# EasyEDA Pro project ProPrj_StepCtlBoard_V1.2_2024-07-15.epro, board PCB1
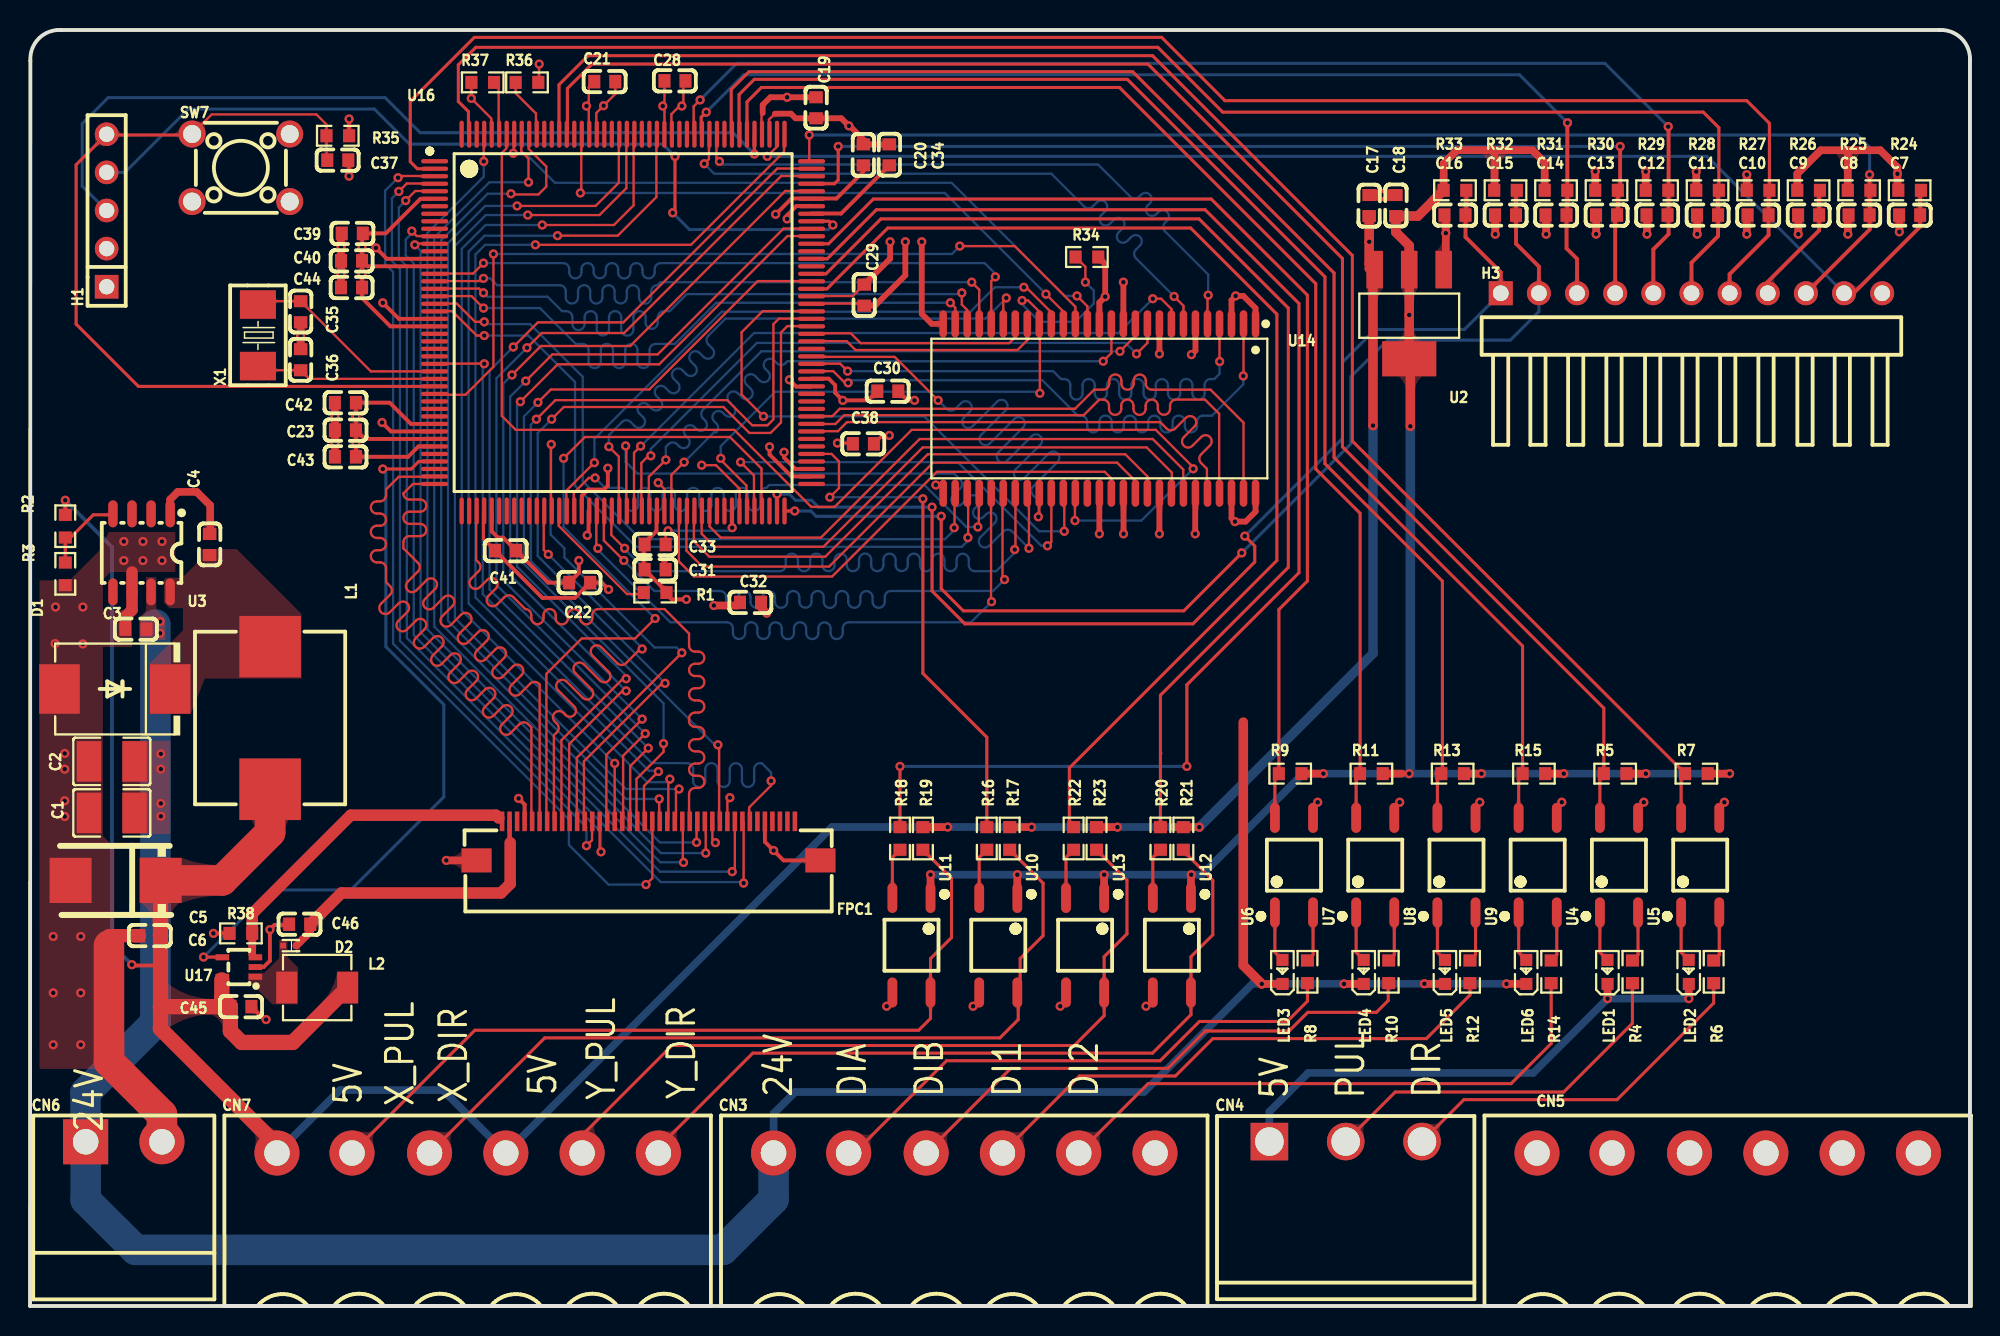
[diagram p2: board, top side]
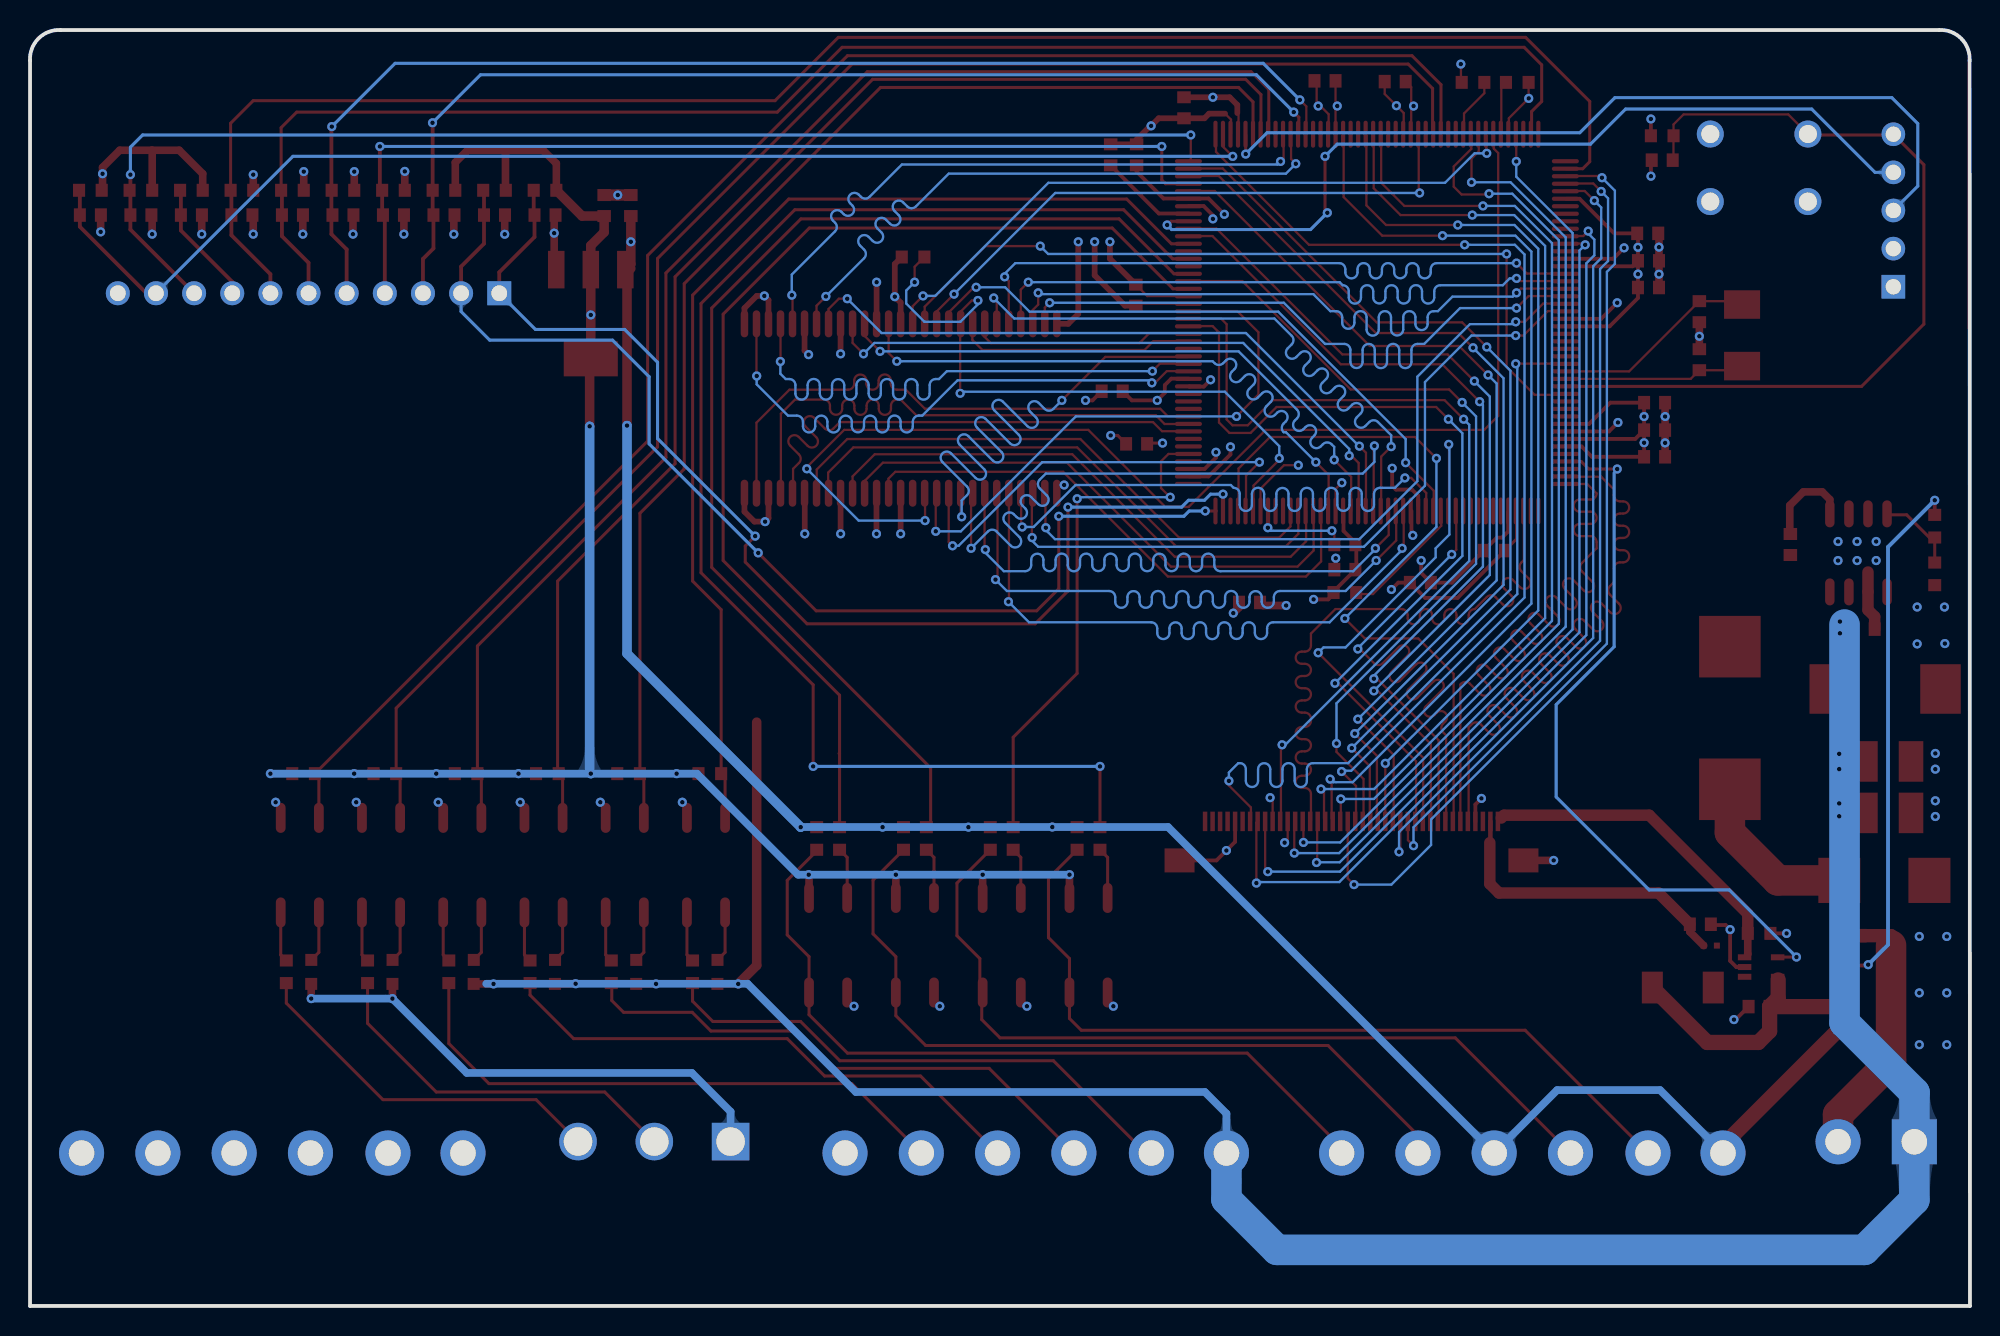
[diagram p3: board, bottom side, seen from below]

Outline 129.18 x 85 mm; copper layers: Top Layer, Inner1, Inner2, Bottom Layer. Coordinates in mm from the lower left corner of the outline.
Outline path: 0,0 0.02,82.97 arc(0.59,84.44) 2.06,85 127.15,85 arc(128.62,84.44) 129.18,82.97 129.18,0 0,0
Stack: Top Layer 0.035mm 外层铜厚1oz / Dielectric1 0.2104mm 7628 RC49% 8.6mil / Inner1 0.0152mm 内层铜厚 / Dielectric2 1.065mm 1.1mm H/HOZ 含铜 / Inner2 0.0152mm 内层铜厚 / Dielectric3 0.2104mm 7628 RC49% 8.6mil / Bottom Layer 0.035mm 外层铜厚1oz

## Design rules (mm)
template: 自定义配置
spacing copperThickness1oz (default): track to track 0.305, other pairs 0.152 to 0.3
spacing copperThickness2oz: track to track 0.203, other pairs 0.152 to 0.3
track width copperThickness1oz (default): min 0.127, default 0.254, max 2.54
track width copperThickness2oz: min 0.203, default 0.254, max 2.54
differential pair differentialPair (default): width min 0.127, default 0.254, max 2.54; gap min 0.152, default 0.152
via viaSize (default): diameter min 0.5, default 0.61, max 10; hole min 0.3, default 0.305, max 6.299

## Placement (name value [footprint] x y rotation side)
C1  4.7uF  [C1210]  5.44 32.85 0 top
C2  4.7uF  [C1210]  5.44 36.28 0 top
C3  10nF  [C0603]  7.05 45.09 180 top
C4  10nF  [C0603]  11.96 50.73 270 top
C5  330uF  [CASE-D_7343]  5.7 28.35 0 top
C6  10nF  [C0603]  7.99 24.67 0 top
C7  100nF  [C0603]  125.17 72.67 180 top
C8  100nF  [C0603]  121.8 72.67 180 top
C9  100nF  [C0603]  118.44 72.67 180 top
C10  100nF  [C0603]  115.07 72.67 180 top
C11  100nF  [C0603]  111.71 72.67 180 top
C12  100nF  [C0603]  108.35 72.67 180 top
C13  100nF  [C0603]  104.98 72.67 180 top
C14  100nF  [C0603]  101.62 72.67 180 top
C15  100nF  [C0603]  98.25 72.67 180 top
C16  100nF  [C0603]  94.89 72.67 180 top
C17  100nF  [C0603]  89.18 73.31 90 top
C18  100nF  [C0603]  90.95 73.31 270 top
C19  100nF  [C0603]  52.34 79.82 270 top
C20  100nF  [C0603]  55.5 76.69 90 top
C21  100nF  [C0603]  38.27 81.56 0 top
C22  100nF  [C0603]  36.6 48.19 0 top
C23  100nF  [C0603]  21 58.35 180 top
C28  100nF  [C0603]  42.95 81.61 0 top
C29  100nF  [C0603]  55.55 67.34 270 top
C30  100nF  [C0603]  57.12 60.94 0 top
C31  100nF  [C0603]  41.63 49.05 180 top
C32  100nF  [C0603]  47.98 46.87 0 top
C33  2.2uF  [C0603]  41.63 50.73 0 top
C34  2.2uF  [C0603]  57.22 76.69 270 top
C35  22pF  [C0603]  18.02 66.24 270 top
C36  22pF  [C0603]  18.02 63.04 90 top
C37  100nF  [C0603]  20.49 76.33 0 top
C38  100nF  [C0603]  55.5 57.43 0 top
C39  100nF  [C0603]  21.46 71.45 180 top
C40  100nF  [C0603]  21.41 69.63 180 top
C41  100nF  [C0603]  31.67 50.32 180 top
C42  100nF  [C0603]  21 60.18 180 top
C43  100nF  [C0603]  21 56.57 180 top
C44  100nF  [C0603]  21.41 67.85 180 top
C45  4.7uF  [C0603]  14.04 19.94 180 top
C46  4.7uF  [C0603]  17.95 25.43 0 top
CN3  WJ2EDGRC-5.08-6P  [CONN-TH_WJ2EDGRC-5.08-6P]  62.21 10.19 0 top
CN4  WJ2EDGRC-5.08-3P  [CONN-TH_3P-P5.08_WJ2EDGRC-5.08-3P]  87.61 10.95 0 top
CN5  WJ2EDGRC-5.08-6P  [CONN-TH_WJ2EDGRC-5.08-6P]  113.05 10.19 0 top
CN6  WJ2EDGRC-5.08-2P  [CONN-TH_2P-P5.08_WJ2EDGRC-5.08-2P]  6.24 10.94 0 top
CN7  WJ2EDGRC-5.08-6P  [CONN-TH_WJ2EDGRC-5.08-6P]  29.14 10.19 0 top
D1  SK1045C  [SMC_L6.9-W5.9-LS7.9-RD]  5.65 41.1 180 top
D2  NSR0240P2T5G  [SOD-923_L0.8-W0.6-LS1.0-RD-1]  17.29 24.01 180 top
FPC1  AFC01-S40FCA-00  [FPC-SMD_P0.50-40P_FGS-XJ-H2.0]  41.19 30.98 180 top
H1  -  [HDR-TH_5P-P2.54-V-F]  5.1 72.98 90 top
H3  PZ254-1-11-W-8.5  [HDR-TH_11P-P2.54-H-M-W10.4-N]  110.64 67.47 0 top
L1  15uH  [IND-SMD_L11.5-W10.0_FXL1040]  15.99 39.17 270 top
L2  4.7uH  [IND-SMD_L4.4-W4.2]  19.12 21.21 0 top
LED1  NCD0603B1  [LED0603-RD]  105.05 22.25 90 top
LED2  NCD0603B1  [LED0603-RD]  110.46 22.25 90 top
LED3  NCD0603B1  [LED0603-RD]  83.41 22.25 90 top
LED4  NCD0603B1  [LED0603-RD]  88.82 22.25 90 top
LED5  NCD0603B1  [LED0603-RD]  94.23 22.25 90 top
LED6  NCD0603B1  [LED0603-RD]  99.64 22.25 90 top
R1  10K  [R0603]  41.63 47.53 0 top
R2  10K  [R0603]  2.35 51.95 90 top
R3  3.16K  [R0603]  2.35 48.77 90 top
R4  1K  [R0603]  106.71 22.26 270 top
R5  2K  [R0603]  105.56 35.46 180 top
R6  1K  [R0603]  112.12 22.26 270 top
R7  2K  [R0603]  110.97 35.46 180 top
R8  4.7K  [R0603]  85.07 22.26 270 top
R9  2K  [R0603]  83.91 35.46 180 top
R10  4.7K  [R0603]  90.48 22.26 270 top
R11  2K  [R0603]  89.33 35.46 180 top
R12  4.7K  [R0603]  95.89 22.26 270 top
R13  2K  [R0603]  94.73 35.46 180 top
R14  4.7K  [R0603]  101.3 22.26 270 top
R15  2K  [R0603]  100.15 35.46 180 top
R16  680R  [R0603]  63.71 31.14 90 top
R17  1K  [R0603]  65.24 31.14 270 top
R18  680R  [R0603]  57.93 31.14 90 top
R19  1K  [R0603]  59.46 31.14 270 top
R20  680R  [R0603]  75.28 31.14 90 top
R21  1K  [R0603]  76.8 31.14 270 top
R22  680R  [R0603]  69.5 31.14 90 top
R23  1K  [R0603]  71.02 31.14 270 top
R24  10K  [R0603]  125.17 74.32 180 top
R25  10K  [R0603]  121.8 74.32 180 top
R26  10K  [R0603]  118.44 74.32 180 top
R27  10K  [R0603]  115.07 74.32 180 top
R28  10K  [R0603]  111.71 74.32 180 top
R29  10K  [R0603]  108.35 74.32 180 top
R30  10K  [R0603]  104.98 74.32 180 top
R31  10K  [R0603]  101.62 74.32 180 top
R32  10K  [R0603]  98.25 74.32 180 top
R33  10K  [R0603]  94.89 74.32 180 top
R34  10K  [R0603]  70.38 69.88 180 top
R35  10K  [R0603]  20.49 77.96 0 top
R36  10K  [R0603]  33.09 81.51 0 top
R37  10K  [R0603]  30.15 81.51 180 top
R38  10.2R  [R0603]  14.04 24.82 0 top
SW7  TS-1002-07026  [SW-TH_4P-L6.0-W6.0-P4.50-LS6.5]  14.04 75.82 0 top
U2  AMS1117-3.3  [SOT-223-3_L6.5-W3.5-P3.05-LS7.0]  91.84 66.07 90 top
U3  TPS5450DDAR  [soic-8_l5.3-w3.9-p1.27-ls6.0-bl]  7.43 50.17 180 top
U4  TLP185(GRL-TL,SE(T  [SOIC-4_L3.6-W4.4-P2.54-LS7.0-TL]  105.81 29.37 90 top
U5  TLP185(GRL-TL,SE(T  [SOIC-4_L3.6-W4.4-P2.54-LS7.0-TL]  111.22 29.37 90 top
U6  TLP185(GRL-TL,SE(T  [SOIC-4_L3.6-W4.4-P2.54-LS7.0-TL]  84.17 29.37 90 top
U7  TLP185(GRL-TL,SE(T  [SOIC-4_L3.6-W4.4-P2.54-LS7.0-TL]  89.58 29.37 90 top
U8  TLP185(GRL-TL,SE(T  [SOIC-4_L3.6-W4.4-P2.54-LS7.0-TL]  94.99 29.37 90 top
U9  TLP185(GRL-TL,SE(T  [SOIC-4_L3.6-W4.4-P2.54-LS7.0-TL]  100.4 29.37 90 top
U10  TLP185(GRL-TL,SE(T  [SOIC-4_L3.6-W4.4-P2.54-LS7.0-TL]  64.48 24.03 270 top
U11  TLP185(GRL-TL,SE(T  [SOIC-4_L3.6-W4.4-P2.54-LS7.0-TL]  58.7 24.03 270 top
U12  TLP185(GRL-TL,SE(T  [SOIC-4_L3.6-W4.4-P2.54-LS7.0-TL]  76.04 24.03 270 top
U13  TLP185(GRL-TL,SE(T  [SOIC-4_L3.6-W4.4-P2.54-LS7.0-TL]  70.26 24.03 270 top
U14  W9825G6KH-6  [TSOP-54_L22.2-W10.2-P0.80-LS11.8-BL]  71.21 59.79 180 top
U16  STM32F429IGT6  [LQFP-176_L24.0-W24.0-P0.50-LS26.0-BL]  39.49 65.51 270 top
U17  TPS61169DCKR  [SC-70-5_L2.1-W1.3-P0.65-LS2.1-BR]  13.91 22.58 0 top
X1  8MHz  [CRYSTAL-SMD_L5.0-W3.2]  15.18 64.66 90 top

## Footprints (pads in the part's own frame, mm; a bottom-side part is the same pattern mirrored in y, then rotated)
C0603
  rect 0.8x0.9 smd: 1(-0.7,0) 2(0.7,0)
C1210
  rect 1.635x2.7 smd: 1(-1.518,0) 2(1.518,0)
CASE-D_7343
  rect 2.799x3.01 smd: 1(3,0) 2(-3,0)
CONN-TH_2P-P5.08_WJ2EDGRC-5.08-2P
  rect 3x3 hole 1.7: 1(-2.54,0)
  round 3 hole 1.7: 2(2.54,0)
CONN-TH_3P-P5.08_WJ2EDGRC-5.08-3P
  rect 2.5x2.5 hole 1.9: 1(-5.08,0)
  round 2.5 hole 1.9: 2(0,0) 3(5.08,0)
CONN-TH_WJ2EDGRC-5.08-6P
  round 3 hole 1.7: 1(-12.7,0) 2(-7.702,0) 3(-2.54,0) 4(2.54,0) 5(7.62,0) 6(12.7,0)
CRYSTAL-SMD_L5.0-W3.2
  rect 1.9x2.4 smd: 1(-2.05,0) 2(2.05,0)
FPC-SMD_P0.50-40P_FGS-XJ-H2.0
  rect 0.3x1.3 smd: 1(9.75,-1.3) 2(9.25,-1.3) 3(8.75,-1.3) 4(8.25,-1.3) 5(7.75,-1.3) 6(7.25,-1.3) 7(6.75,-1.3) 8(6.25,-1.3) 9(5.75,-1.3) 10(5.25,-1.3) 11(4.75,-1.3) 12(4.25,-1.3) 13(3.75,-1.3) 14(3.25,-1.3) 15(2.75,-1.3) 16(2.25,-1.3) 17(1.75,-1.3) 18(1.25,-1.3) 19(0.75,-1.3) 20(0.25,-1.3) 21(-0.25,-1.3) 22(-0.75,-1.3) 23(-1.25,-1.3) 24(-1.75,-1.3) 25(-2.25,-1.3) 26(-2.75,-1.3) 27(-3.25,-1.3) 28(-3.75,-1.3) 29(-4.25,-1.3) 30(-4.75,-1.3) 31(-5.25,-1.3) 32(-5.75,-1.3) 33(-6.25,-1.3) 34(-6.75,-1.3) 35(-7.25,-1.3) 36(-7.75,-1.3) 37(-8.25,-1.3) 38(-8.75,-1.3) 39(-9.25,-1.3) 40(-9.75,-1.3)
  rect 2x1.6 smd: 41(-11.45,1.3) 42(11.45,1.3)
HDR-TH_5P-P2.54-V-F
  rect 1.575x1.575 hole 1.02: 1(-5.08,0)
  round 1.575 hole 1.02: 2(-2.54,0) 3(0,0) 4(2.54,0) 5(5.08,0)
HDR-TH_11P-P2.54-H-M-W10.4-N
  rect 1.6x1.6 hole 1.05: 1(-12.7,0)
  round 1.6 hole 1.05: 2(-10.16,0) 3(-7.62,0) 4(-5.08,0) 5(-2.54,0) 6(0,0) 7(2.54,0) 8(5.08,0) 9(7.62,0) 10(10.16,0) 11(12.7,0)
IND-SMD_L4.4-W4.2
  rect 1.4x2.12 smd: 1(2.028,0) 2(-2.028,0)
IND-SMD_L11.5-W10.0_FXL1040
  rect 4.1x4.1 smd: 1(-4.75,0) 2(4.75,0)
LED0603-RD
  rect 0.8x0.8 smd: 1(-0.799,-0.004) 2(0.799,0.004)
LQFP-176_L24.0-W24.0-P0.50-LS26.0-BL
  oval 0.28x1.8 smd: 1(-10.75,-12.55) 2(-10.25,-12.55) 3(-9.75,-12.55) 4(-9.25,-12.55) 5(-8.75,-12.55) 6(-8.25,-12.55) 7(-7.75,-12.55) 8(-7.25,-12.55) 9(-6.75,-12.55) 10(-6.25,-12.55) 11(-5.75,-12.55) 12(-5.25,-12.55) 13(-4.75,-12.55) 14(-4.25,-12.55) 15(-3.75,-12.55) 16(-3.25,-12.55) 17(-2.75,-12.55) 18(-2.25,-12.55) 19(-1.75,-12.55) 20(-1.25,-12.55) 21(-0.75,-12.55) 22(-0.25,-12.55) 23(0.25,-12.55) 24(0.75,-12.55) 25(1.25,-12.55) 26(1.75,-12.55) 27(2.25,-12.55) 28(2.75,-12.55) 29(3.25,-12.55) 30(3.75,-12.55) 31(4.25,-12.55) 32(4.75,-12.55) 33(5.25,-12.55) 34(5.75,-12.55) 35(6.25,-12.55) 36(6.75,-12.55) 37(7.25,-12.55) 38(7.75,-12.55) 39(8.25,-12.55) 40(8.75,-12.55) 41(9.25,-12.55) 42(9.75,-12.55) 43(10.25,-12.55) 44(10.75,-12.55) 89(10.75,12.55) 90(10.25,12.55) 91(9.75,12.55) 92(9.25,12.55) 93(8.75,12.55) 94(8.25,12.55) 95(7.75,12.55) 96(7.25,12.55) 97(6.75,12.55) 98(6.25,12.55) 99(5.75,12.55) 100(5.25,12.55) 101(4.75,12.55) 102(4.25,12.55) 103(3.75,12.55) 104(3.25,12.55) 105(2.75,12.55) 106(2.25,12.55) 107(1.75,12.55) 108(1.25,12.55) 109(0.75,12.55) 110(0.25,12.55) 111(-0.25,12.55) 112(-0.75,12.55) 113(-1.25,12.55) 114(-1.75,12.55) 115(-2.25,12.55) 116(-2.75,12.55) 117(-3.25,12.55) 118(-3.75,12.55) 119(-4.25,12.55) 120(-4.75,12.55) 121(-5.25,12.55) 122(-5.75,12.55) 123(-6.25,12.55) 124(-6.75,12.55) 125(-7.25,12.55) 126(-7.75,12.55) 127(-8.25,12.55) 128(-8.75,12.55) 129(-9.25,12.55) 130(-9.75,12.55) 131(-10.25,12.55) 132(-10.75,12.55)
  oval 1.8x0.28 smd: 45(12.55,-10.75) 46(12.55,-10.25) 47(12.55,-9.75) 48(12.55,-9.25) 49(12.55,-8.75) 50(12.55,-8.25) 51(12.55,-7.75) 52(12.55,-7.25) 53(12.55,-6.75) 54(12.55,-6.25) 55(12.55,-5.75) 56(12.55,-5.25) 57(12.55,-4.75) 58(12.55,-4.25) 59(12.55,-3.75) 60(12.55,-3.25) 61(12.55,-2.75) 62(12.55,-2.25) 63(12.55,-1.75) 64(12.55,-1.25) 65(12.55,-0.75) 66(12.55,-0.25) 67(12.55,0.25) 68(12.55,0.75) 69(12.55,1.25) 70(12.55,1.75) 71(12.55,2.25) 72(12.55,2.75) 73(12.55,3.25) 74(12.55,3.75) 75(12.55,4.25) 76(12.55,4.75) 77(12.55,5.25) 78(12.55,5.75) 79(12.55,6.25) 80(12.55,6.75) 81(12.55,7.25) 82(12.55,7.75) 83(12.55,8.25) 84(12.55,8.75) 85(12.55,9.25) 86(12.55,9.75) 87(12.55,10.25) 88(12.55,10.75) 133(-12.55,10.75) 134(-12.55,10.25) 135(-12.55,9.75) 136(-12.55,9.25) 137(-12.55,8.75) 138(-12.55,8.25) 139(-12.55,7.75) 140(-12.55,7.25) 141(-12.55,6.75) 142(-12.55,6.25) 143(-12.55,5.75) 144(-12.55,5.25) 145(-12.55,4.75) 146(-12.55,4.25) 147(-12.55,3.75) 148(-12.55,3.25) 149(-12.55,2.75) 150(-12.55,2.25) 151(-12.55,1.75) 152(-12.55,1.25) 153(-12.55,0.75) 154(-12.55,0.25) 155(-12.55,-0.25) 156(-12.55,-0.75) 157(-12.55,-1.25) 158(-12.55,-1.75) 159(-12.55,-2.25) 160(-12.55,-2.75) 161(-12.55,-3.25) 162(-12.55,-3.75) 163(-12.55,-4.25) 164(-12.55,-4.75) 165(-12.55,-5.25) 166(-12.55,-5.75) 167(-12.55,-6.25) 168(-12.55,-6.75) 169(-12.55,-7.25) 170(-12.55,-7.75) 171(-12.55,-8.25) 172(-12.55,-8.75) 173(-12.55,-9.25) 174(-12.55,-9.75) 175(-12.55,-10.25) 176(-12.55,-10.75)
R0603
  rect 0.806x0.864 smd: 1(-0.753,0) 2(0.753,0)
SC-70-5_L2.1-W1.3-P0.65-LS2.1-BR
  rect 0.9x0.4 smd: 1(1.1,-0.65) 2(1.1,0) 3(1.1,0.65) 4(-1.1,0.65) 5(-1.1,-0.65)
SMC_L6.9-W5.9-LS7.9-RD
  rect 2.7x3.3 smd: 1(-3.687,0) 2(3.687,0)
SOD-923_L0.8-W0.6-LS1.0-RD-1
  rect 0.4x0.4 smd: 1(-0.44,0) 2(0.44,0)
SOIC-4_L3.6-W4.4-P2.54-LS7.0-TL
  oval 2x0.65 smd: 1(-3.15,1.27) 3(-3.15,-1.27) 4(3.15,-1.27) 6(3.15,1.27)
soic-8_l5.3-w3.9-p1.27-ls6.0-bl
  oval 0.63x1.8 smd: 1(-1.905,-2.6) 2(-0.635,-2.6) 3(0.635,-2.6) 4(1.905,-2.6) 5(1.905,2.6) 6(0.635,2.6) 7(-0.635,2.6) 8(-1.905,2.6)
SOT-223-3_L6.5-W3.5-P3.05-LS7.0
  rect 2.5x1.1 smd: 1(2.97,-2.3) 2(2.97,0) 3(2.97,2.3)
  rect 2.34x3.6 smd: 4(-2.97,0)
SW-TH_4P-L6.0-W6.0-P4.50-LS6.5
  round 1.8 hole 1.2: 1(-3.25,2.25) 2(3.25,2.25) 3(-3.25,-2.25) 4(3.25,-2.25)
TSOP-54_L22.2-W10.2-P0.80-LS11.8-BL
  oval 0.5x1.8 smd: 1(-10.4,-5.642) 2(-9.6,-5.642) 3(-8.8,-5.642) 4(-8,-5.642) 5(-7.2,-5.642) 6(-6.4,-5.642) 7(-5.6,-5.642) 8(-4.8,-5.642) 9(-4,-5.642) 10(-3.2,-5.642) 11(-2.4,-5.642) 12(-1.6,-5.642) 13(-0.8,-5.642) 14(0,-5.642) 15(0.8,-5.642) 16(1.6,-5.642) 17(2.4,-5.642) 18(3.2,-5.642) 19(4,-5.642) 20(4.8,-5.642) 21(5.6,-5.642) 22(6.4,-5.642) 23(7.2,-5.642) 24(8,-5.642) 25(8.8,-5.642) 26(9.6,-5.642) 27(10.4,-5.642) 28(10.4,5.642) 29(9.6,5.642) 30(8.8,5.642) 31(8,5.642) 32(7.2,5.642) 33(6.4,5.642) 34(5.6,5.642) 35(4.8,5.642) 36(4,5.642) 37(3.2,5.642) 38(2.4,5.642) 39(1.6,5.642) 40(0.8,5.642) 41(0,5.642) 42(-0.8,5.642) 43(-1.6,5.642) 44(-2.4,5.642) 45(-3.2,5.642) 46(-4,5.642) 47(-4.8,5.642) 48(-5.6,5.642) 49(-6.4,5.642) 50(-7.2,5.642) 51(-8,5.642) 52(-8.8,5.642) 53(-9.6,5.642) 54(-10.4,5.642)

## Nets
As in the schematic.

Pads without a net: FPC1 3 35 37 38 39 40; SW7 2 4; U3 2 3 5; U14 40; U16 1 7 8 9 10 13 24 25 26 27 33 34 35 40 42 45 46 50 51 52 53 54 55 79 80 86 89 92 94 95 99 100 101 107 118 120 141 146 147 151 152 156 157 161 164 165 174 176

## Via types
v1: diameter 0.61, hole 0.305, Top Layer to Bottom Layer, 278 vias

## Routing (per net, layer and track width the routed paths; a pad name or vN(x,y) marks a point on that pad's centre or on a via; arc(x,y) is an arc through that point)
3V3: length 271.8
  Top Layer w0.152: v1(41.83,54.84) 42.24,54.43 42.24,53.47 ; 37.21,78.08 37.21,81.2 C21.1 ; C29.1 54.78,67.28 52.01,67.28 ; 48.71,79.33 48.71,78.08 ; 30.71,78.08 30.71,79.12 29.39,80.44 R37.2 ; 42.21,78.08 42.25,78.12 C28.1 ; 47.24,53.47 47.24,54.44 45.68,56.01 v1(44.73,56.01) ; FPC1.31 46.44,33.69 v1(46.61,33.86)
  Top Layer w0.203: v1(53.77,57.48) 54.74,57.48 C38.1
  Top Layer w0.254: 26.89,58.76 25.36,58.76 23.95,60.18 C42.1 v1(21.7,59.25) C23.1 ; 26.89,57.26 25.87,57.26 25.17,56.57 C43.1 v1(21.7,57.51) C23.1 ; C40.1 v1(22.11,70.53) 22.11,71.4 C39.1 23.54,71.45 ; C40.1 22.47,69.26 26.74,69.26 ; C40.1 v1(22.11,68.74) C44.1 22.11,67.15 24,65.26 26.89,65.26 ; 26.89,73.76 26,73.76 23.69,71.45 ; v1(32.53,33.81) 32.94,33.41 FPC1.4 ; C30.1 55.81,60.33 v1(54.12,60.33) 53.62,60.84 53.62,61.34 53.18,61.78 52.01,61.78 ; v1(37.11,51.34) 37.19,51.42 37.19,52.96 ; v1(42.24,49.81) 42.24,49.14 C31.1 ; 30.75,52.9 30.75,51.6 31.16,51.18 31.51,51.18 C41.1 34.5,48.19 C22.1 36.55,48.84 v1(36.55,49.66) ; C23.1 22.29,57.76 26.89,57.76 ; R35.2 v1(21.25,79.07) ; 51.99,55.76 50.97,55.76 50.21,56.52 v1(50.21,56.87) ; v1(49.65,72.72) 50.71,73.78 53.7,73.78 55.5,75.57 C20.1
  Top Layer w0.381: 48.79,79.47 48.79,80.01 49.3,80.52 v1(50.42,80.52) C19.1 ; 80.01,65.43 80.01,67.01 v1(80.29,67.29) 80.79,67.29 81.61,66.47 81.61,65.43 ; v1(59.38,70.9) 59.38,66.09 60.05,65.43 60.81,65.43 ; U14.43 72.82,54.13 v1(72.82,51.44) ; C29.1 57.27,69.77 v1(57.27,70.9) ; 75.21,65.43 v1(75.21,63.43) ; U14.49 77.59,54.13 v1(77.59,51.44) ; R34.1 71.6,69.41 v1(71.6,67.24) 71.21,66.85 71.21,65.43
  Top Layer w0.508: 97.52,76.99 100.05,76.99 100.86,76.18 R31.2 ; 97.52,76.99 97.52,74.35 R32.2 ; 97.52,76.99 95.02,76.99 94.14,76.11 R33.2 ; R7.1 v1(113.18,35.46) ; 121.07,76.99 121.05,76.97 R25.2 ; 121.07,76.99 123.21,76.99 124.35,75.85 v1(124.35,75.42) 124.35,74.38 R24.2 ; 121.07,76.99 119.25,76.99 117.68,75.43 R26.2 ; 65.75,27.18 v1(65.75,28.73) ; v1(114.32,75.37) R27.2 ; 77.31,27.18 77.31,28.73 ; R13.1 96.67,35.46 ; R15.1 102.13,35.46 ; R11.1 91.33,35.46 ; 59.97,27.18 v1(59.97,28.73) ; v1(45.54,46.66) 47.07,46.66 C32.1 ; 104.23,74.34 v1(104.23,75.58) ; R29.2 v1(107.59,75.57) ; 71.53,27.18 v1(71.53,28.73) ; R5.1 107.59,35.46 ; R28.2 v1(110.96,75.57) ; R9.1 v1(86.13,35.46)
  Top Layer w0.635: R33.2 92.42,72.61 C18.2 90.95,71.53 91.84,70.64 U2.2 v1(91.84,66.02) U2.4 91.92,63.02 v1(91.92,58.6)
  Bottom Layer w0.508: v1(59.97,28.73) v1(65.75,28.73) v1(71.53,28.73) v1(77.33,28.73) 78.04,28.73 84.77,35.46 v1(86.13,35.46) v1(91.84,35.46) v1(96.66,35.46) v1(102.13,35.46) v1(107.6,35.46) v1(113.18,35.46)
  Bottom Layer w0.635: v1(91.92,58.6) 91.92,35.54 v1(91.84,35.46)
  vias: v1(29.38,80.45) v1(37.05,79.94) v1(42.13,79.94)
+5V: length 212.7
  Top Layer w0.254: 8.69,22.68 6.83,22.68 v1(6.78,22.74) ; R2.2 v1(2.35,53.67)
  Top Layer w0.508: 77.87,31.9 v1(77.86,31.9) ; v1(77.86,31.9) R21.1 76.11,31.9 ; v1(77.86,31.9) 77.87,31.91 ; R17.1 v1(66.7,31.9) ; R19.1 61.11,31.9 ; R23.1 v1(72.41,31.9)
  Top Layer w0.635: C17.1 v1(89.18,70.9) 89.18,69.41 U2.3 ; v1(89.43,58.65) 89.43,68.86 89.18,69.12
  Top Layer w1.016: C45.2 8.72,19.94 8.69,19.9 ; C45.2 12.77,20.51 12.77,21.72 ; C45.2 13.34,18.31 14.09,17.56 17.49,17.56 L2.1 ; 8.69,19.9 C6.2 8.69,28.34 C5.1 ; 8.69,19.9 8.69,18.47 16.44,10.71 CN7.1
  Top Layer w2.032: C5.1 12.8,28.35 15.99,31.54 15.99,34.62
  Bottom Layer w0.254: v1(2.35,53.67) 5.46,50.56 5.46,24.06 v1(6.78,22.74)
  Bottom Layer w0.508: CN7.1 20.63,14.38 27.49,14.38 CN7.4 53.4,31.91 v1(61.11,31.91) 77.87,31.91
  Bottom Layer w0.635: v1(77.86,31.9) 89.43,43.46 v1(89.43,58.65)
+24V: length 170.7
  Top Layer w0.508: LED4.1 v1(87.5,21.45) ; LED3.1 v1(82.02,21.45) ; LED6.1 v1(98.32,21.45) ; 94.23,21.45 92.93,21.45
  Top Layer w0.635: 80.79,38.89 80.79,22.69 v1(82.02,21.45)
  Bottom Layer w0.508: 98.8,21.47 v1(92.85,21.47) 81.4,21.47 74.19,14.25 50.95,14.25 49.51,12.82 CN3.1
  Bottom Layer w2.032: CN3.1 49.51,7.1 46.15,3.74 7.03,3.74 3.7,7.07 3.7,10.94 3.69,14.22 8.35,18.88 8.35,45.39
  vias: v1(8.66,45.59) v1(8.66,44.81) v1(8.71,36.78) v1(8.71,35.76) v1(8.71,33.48) v1(8.71,32.62)
GND: length 155.2
  Top Layer w0.152: v1(33.91,82.73) 33.9,82.72 33.9,81.56 ; C21.2 38.97,80.74 v1(38.19,79.96) 37.71,79.47 37.71,78.08 ; C28.2 43.51,81.47 43.51,80.19 42.71,79.39 42.71,78.08 ; 49.21,78.08 49.21,79.04 49.6,79.43 ; 52.01,66.78 55.41,66.78 C29.2 ; FPC1.29 45.44,31.07 v1(45.64,30.86)
  Top Layer w0.203: C38.2 56.75,57.99 v1(57.22,57.99) ; C41.2 30.19,51.1 30.19,52.91
  Top Layer w0.254: C30.2 58.43,60.33 v1(58.9,60.33) ; 21.14,76.33 21.24,76.23 v1(21.24,75.26) ; v1(23.03,70.49) 23.76,69.76 26.89,69.76 ; v1(38.48,55.81) 38.48,54.64 38.22,54.39 37.16,54.39 36.74,53.97 36.74,53.29 ; FPC1.41 50.17,29.68 v1(49.52,30.34) 48.94,30.92 FPC1.36 ; 26.89,65.76 24.56,65.76 v1(23.49,66.83) ; C46.1 17.2,25.38 16.28,25.38 v1(15.97,25.07) 15.97,22.99 15.56,22.58 U17.2 ; v1(49.25,57.23) 49.25,56.72 50.71,55.26 51.99,55.26 ; C45.1 15.61,19.08 v1(15.72,19.08) ; v1(38.53,47.73) 38.07,48.19 C22.2 36.28,47.17 34.12,47.17 C41.2 ; R38.1 v1(12.21,24.82) ; 51.99,61.26 51.98,61.24 51.02,61.24 v1(50.57,61.7) ; 52.01,73.28 51.03,73.28 50.42,72.66 v1(50.42,72.42) ; v1(43.71,47.07) 42.74,47.07 42.38,47.43 42.38,47.6 C31.2 40.86,49.11 40.86,50.78 41.72,51.63 41.72,52.94 ; v1(23.44,58.86) 24.04,58.26 26.89,58.26
  Top Layer w0.381: v1(58.29,70.9) 58.29,68.66 56.27,66.64 C29.2 ; U14.54 81.61,52.91 80.95,52.25 v1(80.23,52.25) 80.01,52.48 U14.52 ; 77.61,65.43 77.61,63.65 v1(77.34,63.38) ; 49.6,79.43 50.67,79.43 50.98,79.12 C19.2 54.03,79.12 v1(54.53,78.62) 54.58,78.62 55.5,77.7 C20.2 C34.1 ; U14.46 75.21,54.14 v1(75.21,51.44) ; 72.81,65.43 v1(72.81,68.2) ; U14.41 v1(71.21,51.44)
  Top Layer w0.508: v1(121.05,71.4) 121.05,72.62 C8.2 ; 27.71,29.7 v1(27.72,29.68) FPC1.42 ; C43.2 v1(20.3,57.5) C23.2 v1(20.3,59.25) C42.2 ; C12.2 107.68,72.64 v1(107.68,71.4) ; C36.2 v1(18.02,64.6) C35.2 ; C39.2 20.71,71.4 v1(20.71,70.54) C40.2 v1(20.71,68.73) C44.2 ; v1(100.96,71.4) 100.96,72.63 C14.2 ; 94.19,72.67 94.28,72.58 v1(94.28,71.47) 94.28,69.18 94.14,69.04 ; v1(117.75,71.4) 117.75,72.66 C9.2 ; v1(97.57,71.4) 97.57,72.65 C15.2 ; v1(111.02,71.4) 111.02,72.66 C11.2 ; 48.99,46.21 48.68,46.52 48.68,46.87 ; v1(104.29,71.4) 104.29,72.67 C13.2 ; v1(124.48,71.56) 124.48,72.66 C7.2 ; C10.2 114.32,72.62 v1(114.32,71.4)
  Top Layer w0.762: C17.2 v1(90.05,74.01) C18.1 ; 6.79,48.9 U3.6 6.79,46.37 6.35,45.92 C3.2
  Top Layer w0.889: 4.8,24.21 5.26,24.67 C6.1
  Top Layer w2.032: 5.25,24.02 5.25,16.29 8.78,12.75 CN6.2
  vias: v1(1.55,24.62) v1(1.55,20.86) v1(1.55,17.4) v1(1.7,46.56) v1(1.67,44.13) v1(2.31,36.81) v1(2.31,35.76) v1(2.31,33.65) v1(2.31,32.61) v1(3.37,24.62) v1(3.37,20.86) v1(3.37,17.4) v1(3.52,46.56) v1(3.52,44.1) v1(6.25,50.93) v1(6.25,49.66) v1(7.52,50.93) v1(7.52,49.66) v1(8.79,50.93) v1(8.79,49.66) v1(43.4,79.94) v1(49.06,46.16) v1(57.04,19.97) v1(60.32,54.69) v1(62.8,19.97) v1(68.6,19.97) v1(74.32,19.97) v1(85.75,33.56) v1(91.21,33.56) v1(96.54,33.56) v1(102,33.56) v1(107.46,33.56) v1(112.83,33.56)
ADD: length 73
  Top Layer w0.203: v1(45.03,79.53) 44.69,79.19 44.69,78.06
  Top Layer w0.254: H3.3 103.02,69.75 102.32,70.45 C14.1 102.37,72.73 R31.1 102.37,78.81 v1(102.38,78.82)
  Bottom Layer w0.203: v1(45.03,79.53) 47.52,82.02 99.18,82.02 v1(102.38,78.82)
BL_GND: length 21.9
  Top Layer w0.508: R38.2 14.8,23.46 14.8,23.45
  Top Layer w0.762: 31.21,32.51 31.02,32.69 21.36,32.69 14.8,26.13 R38.2
BL_PWM: length 48.5
  Top Layer w0.203: v1(23.49,55.76) 25.39,55.76 25.89,56.26 26.89,56.26 ; U17.4 12.79,23.24 v1(11.55,23.24)
  Bottom Layer w0.203: v1(11.55,23.24) 16.02,27.72 21.36,27.72 27.56,33.91 27.56,40.06 23.69,43.92 23.69,55.5
BL_VCC: length 20.4
  Top Layer w0.305: FPC1.2 31.94,30.9 31.97,30.86
  Top Layer w0.508: C46.2 18.65,24.93 D2.1
  Top Layer w0.762: C46.2 20.74,27.51 31.37,27.51 31.97,28.12 31.97,30.86
CONF: length 66.2
  Top Layer w0.203: 51.99,74.76 53.57,74.76 53.82,75.01 v1(53.82,77.25)
  Top Layer w0.254: v1(105.89,77.25) 105.89,74.48 R30.1 105.74,72.73 C13.1 105.56,72.55 H3.4
  Bottom Layer w0.203: v1(105.89,77.25) v1(53.82,77.25)
DI1: length 36.3
  Top Layer w0.203: CN3.4 69.88,15.32 76.27,15.32 78.76,17.81 92.99,17.81 95.89,20.71 R12.2
DI2: length 38.5
  Top Layer w0.203: R14.2 101.3,17.48 98.62,14.81 74.46,14.81 CN3.5
DIA: length 36
  Top Layer w0.203: CN3.2 54.89,10.19 61.03,16.34 75.26,16.34 77.87,18.95 83.71,18.95 85.07,20.3 R8.2
DIB: length 36.2
  Top Layer w0.203: R10.2 90.45,21.48 90.45,20.35 89.66,19.56 85.09,19.56 83.84,18.32 78.25,18.32 75.76,15.83 65.31,15.83 CN3.3
DIR1: length 55.9
  Top Layer w0.203: R17.2 67.46,28.17 67.46,24.67 65.93,23.14 65.93,21.07 U10.6 65.81,20.82 65.81,19.08 64.59,17.86 34.27,17.86 CN7.3
DIR2: length 51.9
  Top Layer w0.203: R21.2 76.8,30.31 78.76,28.35 78.76,24.72 77.31,23.27 U12.6 77.31,19.4 74.75,16.84 48.13,16.84 41.84,10.56 CN7.6
DO1: length 93.5
  Top Layer w0.203: v1(77.03,35.94) 77.03,41.38 84.5,48.85 84.5,66.78 78.25,73.03 56.36,73.03 53.09,69.76 51.99,69.76 ; v1(57.93,35.94) R18.2
  Bottom Layer w0.203: v1(77.03,35.94) v1(57.93,35.94)
DO2: length 34.6
  Top Layer w0.152: v1(53.26,53.88) 53.87,54.49 53.87,56.26 53.37,56.76 51.99,56.76
  Top Layer w0.203: R16.2 63.71,37.89 59.46,42.14 v1(59.46,53.78)
  Bottom Layer w0.152: v1(53.26,53.88) 59.36,53.88 v1(59.46,53.78)
DO3: length 75.1
  Top Layer w0.152: R22.2 69.21,32.18
  Top Layer w0.203: 51.99,67.76 53.07,67.76 57.12,71.81 77.29,71.81 83.03,66.07 83.03,49.66 69.21,35.84 69.21,32.18
DO4: length 74
  Top Layer w0.203: 75.28,36.78 R20.2 75.21,31.97 ; 75.28,36.78 75.28,40.69 83.79,49.2 83.79,66.48 77.85,72.42 56.66,72.42 53,68.76 51.99,68.76 ; 75.28,36.78 75.31,36.81
DOWN: length 112.8
  Top Layer w0.203: 26.89,75.76 25.79,75.76 25.32,76.23 25.32,80.24 29.59,84.51 75.36,84.51 79.57,80.29 114.32,80.29 115.83,78.79 R27.1
  Top Layer w0.254: H3.7 113.18,68.74 115.77,71.33 C10.1 115.77,74.27 R27.1
IN_5V: length 35
  Top Layer w0.508: LED2.1 v1(110.46,20.48) ; LED1.1 v1(105.05,20.48)
  Bottom Layer w0.508: 82.53,10.95 82.53,12.94 85.11,15.52 100.1,15.52 v1(105.05,20.48) v1(110.46,20.48)
IN_DIR: length 24.6
  Top Layer w0.203: R6.2 112.12,20.18 105.69,13.75 95.49,13.75 92.69,10.95
IN_PUL: length 25
  Top Layer w0.203: 87.61,10.95 90.91,14.25 102.13,14.25 106.71,18.83 R4.2
INPUT1: length 105.2
  Top Layer w0.203: U4.6 104.54,35.2 R5.2 104.8,39.83 87.4,57.23 87.4,69.78 74.44,82.73 37.41,82.73 35.78,81.11 35.78,78.15
INPUT2: length 109.2
  Top Layer w0.203: 35.19,78.06 35.23,78.09 35.23,81.36 37.16,83.29 74.75,83.29 88.06,69.98 88.06,57.62 R7.2 109.95,35.2 U5.6
INPUT3: length 72.7
  Top Layer w0.203: U6.6 82.9,35.2 R9.2 83.16,46.39 85.06,48.29 85.06,67.34 78.66,73.74 56.16,73.74 53.18,70.76 51.99,70.76
INPUT4: length 82.8
  Top Layer w0.203: U16.138 47.74,80.21 48.71,81.17 72.55,81.17 85.62,68.1 85.62,55.76 88.57,52.8 R11.2 88.31,35.2 U7.6
INPUT5: length 87.3
  Top Layer w0.203: 47.21,78.08 47.21,80.7 48.23,81.72 73.07,81.72 86.23,68.56 86.23,56.11 94.05,48.29 94.05,35.53 R13.2 ; R13.2 93.72,35.2 U8.6 ; R13.2 93.62,35.46
INPUT6: length 90.8
  Top Layer w0.203: U9.6 99.13,35.2 R15.2 99.39,43.97 86.84,56.52 86.84,68.81 73.43,82.22 47.88,82.22 46.69,81.04 46.69,78.06
LEFT: length 103.3
  Top Layer w0.203: 29.19,78.06 29.19,79.57 28.52,80.24 28.52,82.68 29.69,83.85 75.1,83.85 79.42,79.53 111.43,79.53 112.46,78.49 R28.1
  Top Layer w0.254: H3.6 110.64,69.5 112.41,71.27 C11.1 112.41,74.27 R28.1
NRST: length 57
  Top Layer w0.152: SW7.1 12.1,79.38 19.07,79.38 19.74,78.71 19.74,77.96 19.74,77.95 19.74,76.33
  Top Layer w0.203: 10.9,78.01 5.15,78.01 H1.5 3.07,76.03 3.07,65.41 7.22,61.26 26.89,61.26
OSC_IN: length 13.7
  Top Layer w0.152: 26.89,62.26 22.7,62.26 C35.1 15.4,66.94 X1.2
OSC_OUT: length 12.1
  Top Layer w0.152: X1.1 15.45,62.34 C36.1 18.6,61.76 26.89,61.76
PC0: length 54.1
  Top Layer w0.152: v1(30.86,70.08) 30.86,62.56 28.99,60.7 26.98,60.7 26.91,60.78 ; 69.61,65.43 69.61,66.57 65.57,70.61 v1(61.91,70.61)
  Bottom Layer w0.152: v1(30.86,70.08) 61.39,70.08 v1(61.91,70.61)
PD0: length 43.5
  Top Layer w0.152: 45.71,78.08 45.71,76.45 v1(45.91,76.25) ; 78.41,65.43 78.41,67.29 v1(78.46,67.34)
  Bottom Layer w0.152: v1(78.46,67.34) 78.46,68.71 75.58,71.59 arc(75.46,71.88) 75.58,72.16 75.72,72.31 arc(75.72,72.88) 75.15,72.88 75,72.74 arc(74.43,72.74) 74.43,73.31 74.57,73.46 arc(74.57,74.03) 74,74.03 73.85,73.89 arc(73.57,73.77) 73.28,73.89 71.13,76.04 46.11,76.04 v1(45.91,76.25)
PD1: length 44.2
  Top Layer w0.152: v1(44.89,76.09) 45.21,76.41 45.21,78.08 ; 76.81,65.43 76.81,66.63 v1(76.19,67.25)
  Bottom Layer w0.152: v1(76.19,67.25) 73.64,69.8 arc(73.52,70.09) 73.64,70.37 73.91,70.65 arc(73.91,71.22) 73.34,71.22 73.07,70.95 arc(72.49,70.95) 72.49,71.52 72.77,71.8 arc(72.77,72.37) 72.19,72.37 71.92,72.1 arc(71.34,72.1) 71.34,72.67 71.62,72.95 arc(71.62,73.52) 71.04,73.52 70.77,73.25 arc(70.48,73.13) 70.19,73.25 68.01,75.43 45.55,75.43 v1(44.89,76.09)
PD8: length 35.7
  Top Layer w0.152: 78.37,53.52 78.37,55.77 77.98,56.16 arc(77.86,56.44) 77.98,56.73 78.57,57.32 arc(78.57,57.89) 77.99,57.89 77.41,57.31 arc(76.83,57.31) 76.83,57.88 77.54,58.59 arc(77.54,59.16) 76.97,59.16 76.26,58.45 arc(75.97,58.34) 75.68,58.45 75.26,58.88 54.4,58.88 53.8,58.28 52.01,58.28
PD9: length 38.2
  Top Layer w0.152: 52.01,58.78 52.03,58.75 53.63,58.75 54.21,59.34 70.17,59.34 71.21,60.38 71.45,60.38 arc(71.73,60.26) 71.85,59.97 71.85,59.77 arc(72.26,59.36) 72.66,59.77 72.66,59.97 arc(73.07,60.38) 73.48,59.97 73.48,59.77 arc(73.88,59.36) 74.29,59.77 74.29,59.97 arc(74.7,60.38) 75.1,59.97 75.1,59.77 arc(75.51,59.36) 75.92,59.77 75.92,59.97 arc(76.03,60.26) 76.32,60.38 78.24,60.38 79.18,59.44 79.18,53.51
PD10: length 38.4
  Top Layer w0.152: 80.81,53.53 80.81,58.84 78.61,61.04 74.71,61.04 arc(74.42,61.16) 74.3,61.45 74.3,61.65 arc(73.9,62.06) 73.49,61.65 73.49,61.45 arc(73.08,61.04) 72.68,61.45 72.68,61.65 arc(72.27,62.06) 71.86,61.65 71.86,61.45 arc(71.75,61.16) 71.46,61.04 70.86,61.04 69.59,59.77 53.92,59.77 53.43,59.28 52.05,59.28
PD14: length 43.4
  Top Layer w0.152: 52.01,62.28 53.48,62.28 54.26,61.5 v1(54.48,61.5) ; 80.81,66.09 80.81,61.97 v1(80.79,61.95)
  Bottom Layer w0.152: v1(80.79,61.95) 80.79,61.4 78.71,59.31 78.12,59.31 arc(77.83,59.19) 77.71,58.91 77.71,58.6 arc(77.31,58.2) 76.9,58.6 76.9,58.91 arc(76.49,59.31) 76.09,58.91 76.09,58.6 arc(75.68,58.2) 75.27,58.6 75.27,58.91 arc(74.87,59.31) 74.46,58.91 74.46,58.6 arc(74.05,58.2) 73.65,58.6 73.65,58.91 arc(73.24,59.31) 72.84,58.91 72.84,58.6 arc(72.43,58.2) 72.02,58.6 72.02,58.91 arc(71.62,59.31) 71.21,58.91 71.21,58.6 arc(70.8,58.2) 70.4,58.6 70.4,58.91 arc(70.28,59.19) 69.99,59.31 69.77,59.31 67.42,61.67 54.65,61.67 v1(54.48,61.5)
PD15: length 43.4
  Top Layer w0.152: v1(79.22,62.92) 79.21,62.93 79.21,65.43 ; v1(54.44,62.28) 53.94,62.78 52.01,62.78
  Bottom Layer w0.152: v1(54.44,62.28) 68.13,62.28 68.65,61.75 68.87,61.75 arc(69.16,61.63) 69.28,61.34 69.28,60.79 arc(69.68,60.38) 70.09,60.79 70.09,61.34 arc(70.5,61.75) 70.9,61.34 70.9,60.79 arc(71.31,60.38) 71.71,60.79 71.71,61.34 arc(72.12,61.75) 72.53,61.34 72.53,60.79 arc(72.93,60.38) 73.34,60.79 73.34,61.34 arc(73.75,61.75) 74.15,61.34 74.15,60.79 arc(74.56,60.38) 74.97,60.79 74.97,61.34 arc(75.37,61.75) 75.78,61.34 75.78,60.79 arc(76.18,60.38) 76.59,60.79 76.59,61.34 arc(77,61.75) 77.4,61.34 77.4,60.79 arc(77.81,60.38) 78.22,60.79 78.22,61.34 arc(78.34,61.63) 78.62,61.75 78.86,61.75 79.22,62.11 v1(79.22,62.92)
PE0: length 44.9
  Top Layer w0.152: v1(32.18,76.79) 32.21,76.82 32.21,78.08 ; v1(69.72,67.29) 70.41,66.6 70.41,65.43
  Bottom Layer w0.152: v1(32.18,76.79) 32.99,76.79 34.96,74.82 61.37,74.82 68.91,67.29 v1(69.72,67.29)
PE1: length 82.6
  Top Layer w0.152: v1(77.46,55.77) 77.46,55.87 74.97,58.36 58.71,58.36 53.58,53.23 52.02,53.23 46.89,58.36 32.35,58.36 31.42,59.29 31.42,76.81 31.71,77.1 31.71,78.08 ; v1(69.58,52.32) 69.58,54.5 69.61,54.53 U14.39
  Bottom Layer w0.152: v1(69.58,52.32) 74,52.32 v1(77.46,55.77)
PE7: length 45.2
  Top Layer w0.152: 40.21,52.98 40.22,52.99 40.22,56.84 v1(40.66,57.28) ; v1(74.76,67.1) 75.32,67.1 76.01,66.42 76.01,65.43
  Bottom Layer w0.152: v1(74.76,67.1) 72.48,64.82 48.21,64.82 40.68,57.28 v1(40.66,57.28)
PE8: length 43
  Top Layer w0.152: 74.41,66.09 74.41,64.16 v1(73.68,63.43) ; 40.71,52.98 40.71,56.16 41.19,56.64 v1(41.34,56.64)
  Bottom Layer w0.152: v1(41.34,56.64) 41.34,57.09 48.4,64.15 72.95,64.15 v1(73.68,63.43)
PE9: length 43.2
  Top Layer w0.152: 41.21,52.98 41.21,55.24 v1(42.34,56.37) ; 73.65,66.13 73.65,64.66 v1(72.58,63.6)
  Bottom Layer w0.152: v1(42.34,56.37) 42.34,57.23 42.51,57.41 arc(42.8,57.53) 43.09,57.41 43.23,57.26 arc(43.81,57.26) 43.81,57.84 43.66,57.98 arc(43.66,58.56) 44.24,58.56 44.38,58.41 arc(44.96,58.41) 44.96,58.99 44.81,59.13 arc(44.69,59.42) 44.81,59.71 48.7,63.6 v1(72.58,63.6)
PE10: length 43.3
  Top Layer w0.152: 42.71,52.98 42.71,55.37 v1(43.56,56.21) ; 72.01,65.43 72.01,63.48 v1(71.46,62.94)
  Bottom Layer w0.152: v1(71.46,62.94) 50.43,62.94 50.3,62.81 arc(50.02,62.69) 49.73,62.81 49.55,62.98 arc(48.98,62.98) 48.98,62.41 49.15,62.23 arc(49.15,61.66) 48.58,61.66 48.28,61.95 arc(47.71,61.95) 47.71,61.38 48.01,61.08 arc(48.01,60.51) 47.43,60.51 47.13,60.81 arc(46.56,60.81) 46.56,60.23 46.86,59.93 arc(46.86,59.36) 46.28,59.36 46.14,59.5 arc(45.56,59.5) 45.56,58.93 45.71,58.79 arc(45.83,58.5) 45.71,58.21 45.55,58.21 v1(43.56,56.21)
PE11: length 37.1
  Top Layer w0.152: 72.02,53.74 72.02,55.11 71.56,55.57 60.39,55.57 53.41,48.59 44.22,48.59 43.21,49.6 43.21,52.98
PE12: length 37.8
  Top Layer w0.152: 73.6,53.5 73.6,54.97 72.39,56.18 60.13,56.18 53.21,49.25 44.78,49.25 43.71,50.32 43.71,52.98
PE13: length 37.9
  Top Layer w0.152: 74.41,53.48 74.41,55.26 72.94,56.74 59.78,56.74 52.96,49.91 45.23,49.91 44.21,50.94 44.21,52.98
PE14: length 38.7
  Top Layer w0.152: 76.03,53.46 76.03,55.52 74.36,57.2 59.45,57.2 52.83,50.58 45.59,50.58 44.73,51.44 44.73,52.96 44.71,52.98
PE15: length 38.6
  Top Layer w0.152: 45.25,52.94 45.25,51.93 46,51.18 52.67,51.18 59.24,57.75 74.76,57.75 76.8,55.72 76.8,53.5
PF0: length 46.7
  Top Layer w0.152: 64.01,65.43 64.01,68.28 v1(64.28,68.56) ; v1(30.2,69.47) 29.5,68.78 26.91,68.78
  Bottom Layer w0.152: v1(30.2,69.47) 35.5,69.47 arc(35.79,69.35) 35.91,69.07 35.91,68.86 arc(36.31,68.46) 36.72,68.86 36.72,69.07 arc(37.13,69.47) 37.53,69.07 37.53,68.86 arc(37.94,68.46) 38.35,68.86 38.35,69.07 arc(38.75,69.47) 39.16,69.07 39.16,68.86 arc(39.57,68.46) 39.97,68.86 39.97,69.07 arc(40.38,69.47) 40.78,69.07 40.78,68.86 arc(41.19,68.46) 41.6,68.86 41.6,69.07 arc(41.72,69.35) 42,69.47 63.57,69.47 64.28,68.76 v1(64.28,68.56)
PF1: length 46.1
  Top Layer w0.152: 26.91,68.28 30.02,68.28 v1(30.2,68.46) ; v1(62.71,68.2) 63.21,67.7 63.21,65.43
  Bottom Layer w0.152: v1(30.2,68.46) 30.65,68.46 31.11,68 35.27,68 arc(35.56,67.88) 35.68,67.59 35.68,67.19 arc(36.08,66.78) 36.49,67.19 36.49,67.59 arc(36.9,68) 37.3,67.59 37.3,67.19 arc(37.71,66.78) 38.11,67.19 38.11,67.59 arc(38.52,68) 38.93,67.59 38.93,67.19 arc(39.33,66.78) 39.74,67.19 39.74,67.59 arc(40.15,68) 40.55,67.59 40.55,67.19 arc(40.96,66.78) 41.37,67.19 41.37,67.59 arc(41.48,67.88) 41.77,68 41.98,68.2 v1(62.71,68.2)
PF2: length 47.1
  Top Layer w0.152: v1(62.05,67.49) 62.05,66.71 62.41,66.35 62.41,65.43 ; v1(30.2,67.49) 29.91,67.78 26.91,67.78
  Bottom Layer w0.152: v1(62.05,67.49) 61.96,67.41 43.73,67.41 42.59,66.27 42.21,66.27 arc(41.92,66.15) 41.81,65.87 41.81,65.5 arc(41.4,65.1) 40.99,65.5 40.99,65.87 arc(40.59,66.27) 40.18,65.87 40.18,65.05 arc(39.77,64.65) 39.37,65.05 39.37,65.87 arc(38.96,66.27) 38.55,65.87 38.55,65.05 arc(38.15,64.65) 37.74,65.05 37.74,65.87 arc(37.34,66.27) 36.93,65.87 36.93,65.42 arc(36.52,65.01) 36.12,65.42 36.12,65.87 arc(36,66.15) 35.71,66.27 35.43,66.27 34.46,67.24 30.45,67.24 v1(30.2,67.49)
PF3: length 46
  Top Layer w0.152: v1(61.29,66.83) 61.61,66.51 61.61,65.43 ; 26.91,67.28 29.4,67.28 30.2,66.48
  Bottom Layer w0.152: 42.95,64.09 41.67,64.09 arc(41.38,63.97) 41.26,63.68 41.26,62.88 arc(40.85,62.48) 40.45,62.88 40.45,63.68 arc(40.04,64.09) 39.63,63.68 39.63,62.88 arc(39.23,62.48) 38.82,62.88 38.82,63.68 arc(38.42,64.09) 38.01,63.68 38.01,62.88 arc(37.6,62.48) 37.2,62.88 37.2,63.68 arc(37.08,63.97) 36.79,64.09 36.34,64.09 33.96,66.48 v1(30.2,66.48) ; 42.95,64.09 45.69,66.83 v1(61.29,66.83) ; 42.95,64.09 42.89,64.09
PF4: length 48.3
  Top Layer w0.152: v1(30.25,65.56) 29.64,65.56 28.42,66.78 26.91,66.78 ; v1(61.54,51.85) 61.57,51.87 61.57,54.76
  Bottom Layer w0.152: 61.54,51.69 60.93,51.08 40.66,51.08 36.8,54.94 36.8,61.9 33.3,65.41 30.25,65.41
PF5: length 50
  Top Layer w0.152: 26.91,66.28 28.11,66.28 29.74,64.65 v1(30.25,64.65) ; 62.47,54.84 62.47,51.2 v1(62.45,51.18)
  Bottom Layer w0.152: 30.25,64.44 30.45,64.65 33.19,64.65 36.29,61.55 36.29,54.64 40.36,50.58 62.05,50.58 62.45,50.98
PF11: length 41.6
  Top Layer w0.152: 68.01,65.43 68.01,66.19 66.33,67.86 v1(66.18,67.86) ; v1(37.58,56.18) 35.71,54.31 35.71,52.98
  Bottom Layer w0.152: v1(37.58,56.18) 37.58,57.75 46.06,66.24 62.62,66.24 64.25,67.86 v1(66.18,67.86)
PF12: length 46.8
  Top Layer w0.152: 36.21,52.98 36.21,54.16 37.21,55.16 v1(37.63,55.16) ; v1(63.11,51.9) 63.18,51.96 63.18,54.32
  Bottom Layer w0.152: v1(63.11,51.9) 62.35,51.9 59.56,54.69 49.22,54.69 49.04,54.5 arc(48.75,54.38) 48.63,54.1 48.63,53.37 arc(48.22,52.96) 47.82,53.37 47.82,54.1 arc(47.41,54.5) 47,54.1 47,53.37 arc(46.6,52.96) 46.19,53.37 46.19,54.1 arc(45.78,54.5) 45.38,54.1 45.38,53.37 arc(44.97,52.96) 44.57,53.37 44.57,54.1 arc(44.16,54.5) 43.75,54.1 43.75,53.37 arc(43.35,52.96) 42.94,53.37 42.94,54.1 arc(42.53,54.5) 42.13,54.1 42.13,53.37 arc(41.72,52.96) 41.31,53.37 41.31,54.1 arc(40.91,54.5) 40.5,54.1 40.5,53.37 arc(40.09,52.96) 39.69,53.37 39.69,54.1 arc(39.57,54.38) 39.28,54.5 38.29,54.5 v1(37.63,55.16)
PF13: length 46.8
  Top Layer w0.152: v1(64.03,46.92) 64,46.95 64,54.79 ; v1(37.82,50.47) 37.71,50.58 37.71,52.98
  Bottom Layer w0.152: 37.89,50.3 42.64,45.55 46.4,45.55 arc(46.69,45.43) 46.81,45.14 46.81,44.83 arc(47.21,44.43) 47.62,44.83 47.62,45.14 arc(48.03,45.55) 48.43,45.14 48.43,44.83 arc(48.84,44.43) 49.25,44.83 49.25,45.14 arc(49.65,45.55) 50.06,45.14 50.06,44.83 arc(50.47,44.43) 50.87,44.83 50.87,45.14 arc(51.28,45.55) 51.68,45.14 51.68,44.83 arc(52.09,44.43) 52.5,44.83 52.5,45.14 arc(52.9,45.55) 53.31,45.14 53.31,44.83 arc(53.72,44.43) 54.12,44.83 54.12,45.14 arc(54.24,45.43) 54.53,45.55 62.66,45.55 v1(64.03,46.92)
PF14: length 47
  Top Layer w0.152: v1(64.89,48.39) 64.76,48.53 64.76,54.09 U14.33 ; 38.21,52.98 38.21,51 v1(39.54,49.66)
  Bottom Layer w0.152: v1(64.89,48.39) 64.13,47.63 57.33,47.63 arc(57.04,47.51) 56.92,47.22 56.92,46.92 arc(56.51,46.51) 56.11,46.92 56.11,47.22 arc(55.7,47.63) 55.3,47.22 55.3,46.92 arc(54.89,46.51) 54.48,46.92 54.48,47.22 arc(54.08,47.63) 53.67,47.22 53.67,46.92 arc(53.26,46.51) 52.86,46.92 52.86,47.22 arc(52.45,47.63) 52.04,47.22 52.04,46.92 arc(51.64,46.51) 51.23,46.92 51.23,47.22 arc(50.82,47.63) 50.42,47.22 50.42,46.92 arc(50.01,46.51) 49.61,46.92 49.61,47.22 arc(49.2,47.63) 48.79,47.22 48.79,46.92 arc(48.39,46.51) 47.98,46.92 47.98,47.22 arc(47.57,47.63) 47.17,47.22 47.17,46.92 arc(46.76,46.51) 46.35,46.92 46.35,47.22 arc(46.23,47.51) 45.95,47.63 41.58,47.63 v1(39.54,49.66)
PF15: length 47
  Top Layer w0.152: 65.62,54.39 65.62,50.44 v1(65.57,50.39) ; v1(39.59,50.47) 38.71,51.36 38.71,52.98
  Bottom Layer w0.152: 39.7,50.32 41.07,48.95 49.92,48.95 arc(50.2,49.07) 50.32,49.36 50.32,49.71 arc(50.73,50.12) 51.14,49.71 51.14,49.36 arc(51.54,48.95) 51.95,49.36 51.95,49.71 arc(52.36,50.12) 52.76,49.71 52.76,49.36 arc(53.17,48.95) 53.58,49.36 53.58,49.71 arc(53.98,50.12) 54.39,49.71 54.39,49.36 arc(54.79,48.95) 55.2,49.36 55.2,49.71 arc(55.61,50.12) 56.01,49.71 56.01,49.36 arc(56.42,48.95) 56.83,49.36 56.83,49.71 arc(57.23,50.12) 57.64,49.71 57.64,49.36 arc(58.05,48.95) 58.45,49.36 58.45,49.71 arc(58.86,50.12) 59.26,49.71 59.26,49.36 arc(59.67,48.95) 60.08,49.36 60.08,49.71 arc(60.48,50.12) 60.89,49.71 60.89,49.36 arc(61.3,48.95) 61.7,49.36 61.7,49.71 arc(62.11,50.12) 62.52,49.71 62.52,49.36 arc(62.63,49.07) 62.92,48.95 64.33,48.95 65.57,50.18
PG0: length 45.7
  Top Layer w0.152: v1(38.54,57.25) 39.21,56.58 39.21,52.98 ; 64.81,65.43 64.81,66.95 v1(65.01,67.15)
  Bottom Layer w0.152: v1(38.54,57.25) 38.54,58.01 39.42,58.89 arc(39.71,59.01) 40,58.89 40.26,58.62 arc(40.83,58.62) 40.83,59.2 40.57,59.46 arc(40.57,60.04) 41.15,60.04 41.41,59.77 arc(41.98,59.77) 41.98,60.35 41.72,60.61 arc(41.72,61.18) 42.3,61.18 42.56,60.92 arc(43.13,60.92) 43.13,61.5 42.87,61.76 arc(42.87,62.33) 43.44,62.33 43.71,62.07 arc(44.28,62.07) 44.28,62.65 44.02,62.91 arc(44.02,63.48) 44.59,63.48 44.86,63.22 arc(45.43,63.22) 45.43,63.79 45.17,64.06 arc(45.05,64.35) 45.17,64.63 46.32,65.78 63.64,65.78 v1(65.01,67.15)
PG1: length 45.7
  Top Layer w0.152: v1(66.52,50.47) 66.52,54.03 66.41,54.14 ; v1(39.66,57.3) 39.71,57.25 39.71,52.98
  Bottom Layer w0.152: v1(39.66,57.3) 39.66,56.23 40.44,55.45 61.54,55.45 61.95,55.04 arc(62.07,54.76) 61.95,54.47 61.48,54 arc(61.47,53.42) 62.05,53.42 62.52,53.89 arc(63.1,53.89) 63.1,53.32 62.91,53.13 arc(62.91,52.56) 63.49,52.56 63.67,52.75 arc(64.25,52.75) 64.25,52.17 63.3,51.22 arc(63.3,50.65) 63.87,50.65 64.82,51.6 arc(65.11,51.72) 65.4,51.6 v1(66.52,50.47)
PG2: length 46.1
  Top Layer w0.152: v1(60.47,60.33) 57.58,63.22 52.06,63.22 52.01,63.28 ; v1(67.14,52.57) 67.21,52.64 U14.36
  Bottom Layer w0.152: v1(60.47,60.33) 61.04,59.76 arc(61.33,59.64) 61.62,59.76 62.02,60.16 arc(62.59,60.16) 62.59,59.58 62.19,59.19 arc(62.19,58.61) 62.77,58.61 64.4,60.25 arc(64.98,60.25) 64.98,59.67 63.34,58.04 arc(63.34,57.46) 63.92,57.46 65.55,59.1 arc(66.13,59.1) 66.13,58.52 64.49,56.89 arc(64.49,56.31) 65.07,56.31 66.7,57.95 arc(67.27,57.95) 67.27,57.37 65.64,55.74 arc(65.64,55.16) 66.21,55.16 67.85,56.8 arc(68.42,56.8) 68.42,56.22 66.79,54.59 arc(66.67,54.3) 66.79,54.01 67.14,53.66 v1(67.14,52.57)
PG4: length 16
  Top Layer w0.152: 66.43,65.43 66.43,64.36 65.76,63.68 54.97,63.68 54.37,64.28 52.01,64.28
PG5: length 15
  Top Layer w0.152: 51.99,64.8 54.65,64.8 55.31,64.14 65.2,64.14 65.62,64.56 65.62,65.42 65.61,65.43
PG8: length 38.6
  Top Layer w0.152: 52.01,66.28 48.79,66.28 47.38,64.87 47.38,60.72 v1(48.84,59.26) ; U14.38 68.81,54.85 68.87,54.78 v1(68.87,51.61)
  Bottom Layer w0.152: v1(68.87,51.61) 67.2,51.61 59.54,59.26 v1(48.84,59.26)
PG15: length 40.2
  Top Layer w0.152: 36.71,78.08 36.71,74.21 v1(36.65,74.15) ; v1(67.65,67.41) 68.81,66.25 68.81,65.43
  Bottom Layer w0.152: v1(67.65,67.41) 60.91,74.15 v1(36.65,74.15)
PH6: length 44.4
  Top Layer w0.152: v1(70.28,68.2) 70.28,69.23 R34.2 ; v1(67.25,60.8) 67.25,65.39 67.21,65.43 67.21,66.24 66.47,66.98 v1(66.06,66.98) ; 47.69,52.96 47.71,52.98 47.71,54.65 46,56.37 v1(46,56.47)
  Bottom Layer w0.152: v1(46,56.47) 46,57.28 49.62,60.9 67.14,60.9 v1(67.25,60.8) ; v1(70.28,68.2) 70.84,67.64 70.84,66.78 69.62,65.56 67.23,65.56 66.06,66.73 v1(66.06,66.98)
PH7: length 30.5
  Top Layer w0.152: 68.01,54.66 68.01,50.9 v1(67.75,50.64) ; 48.21,52.98 48.21,55.32 v1(47.32,56.21)
  Bottom Layer w0.152: v1(47.32,56.21) 61.78,56.21 67.35,50.64 v1(67.75,50.64)
PUL1: length 54.8
  Top Layer w0.203: CN7.2 29.62,18.37 59.18,18.37 59.97,19.16 U11.6 59.97,23.14 61.36,24.54 61.36,28.49 R19.2
PUL2: length 51.8
  Top Layer w0.203: CN7.5 36.76,11.37 42.74,17.35 69.54,17.35 71.53,19.34 U13.6 71.53,23.27 73.05,24.79 73.05,28.36 R23.2
RIGHT: length 84.3
  Top Layer w0.152: v1(51.89,78.01) 51.89,76.36 51.99,76.26
  Top Layer w0.254: 122.5,74.27 v1(122.5,75.37) ; 122.5,74.27 R25.1 ; 122.5,74.27 C8.1 122.5,71.71 H3.9
  Bottom Layer w0.203: v1(51.89,78.01) 121.69,78.01 122.5,77.19 v1(122.5,75.37)
S_RST: length 86.6
  Top Layer w0.152: 49.69,78.06 49.69,77.18 v1(49.09,76.58)
  Top Layer w0.254: H3.10 121.43,67.47 125.87,71.9 C7.1 125.87,74.27 R24.1
  Bottom Layer w0.203: v1(49.09,76.58) 111.68,76.58 H3.10
SET: length 76.9
  Top Layer w0.203: v1(60.07,53.22) 60.07,47.63 62.25,45.44 77.44,45.44 81.56,49.56 81.56,50.63 v1(80.89,51.29)
  Top Layer w0.254: R33.1 95.64,72.73 C16.1 95.59,71.21 97.94,68.86 H3.1
  Bottom Layer w0.203: v1(49.74,54.08) 50.57,54.08 50.97,53.67 52.04,53.67 52.5,53.22 v1(60.07,53.22) ; v1(80.89,51.29) 87.4,57.79 87.4,62.87 89.58,65.05 95.53,65.05 H3.1
SUB: length 75.5
  Top Layer w0.203: 50.19,52.96 v1(50.92,52.96) ; v1(80.69,50.17) 76.83,46.31 62.15,46.31 60.68,47.78 v1(60.68,52.61)
  Top Layer w0.254: R32.1 98.95,74.27 C15.1 98.95,70.77 100.48,69.24 H3.2
  Bottom Layer w0.203: v1(80.69,50.17) 87.96,57.43 87.96,61.9 90.39,64.34 98.57,64.34 100.48,66.25 H3.2 ; v1(60.68,52.61) 52.35,52.61 51.99,52.96 v1(50.92,52.96)
SWCLK: length 54.8
  Top Layer w0.203: v1(48.23,76.74) 48.23,78.02
  Bottom Layer w0.203: H1.3 3.48,74.6 3.48,78.77 5.2,80.5 23.64,80.5 25.98,78.16 46.81,78.16 v1(48.23,76.74)
SWDIO: length 57.5
  Top Layer w0.203: v1(42.95,76.58) 42.95,72.98 v1(42.8,72.83) ; 51.99,72.26 53.22,72.26 v1(53.46,72.01)
  Bottom Layer w0.203: 5.1,75.52 6.32,75.52 10.54,79.73 22.93,79.73 25.27,77.4 42.13,77.4 v1(42.95,76.58) ; v1(53.46,72.01) 53.16,71.71 43.91,71.71 v1(42.8,72.83)
SWI: length 81.5
  Top Layer w0.152: 44.19,78.06 44.19,79.91 v1(44.62,80.34)
  Top Layer w0.203: 107.97,67.34 H3.5
  Top Layer w0.254: 109.11,72.61 C12.1 ; 109.11,72.61 109.11,71.4 108.1,70.39 H3.5 ; 109.11,72.61 109.11,74.31 ; v1(109.09,78.57) 109.11,78.54 109.11,74.31 ; 109.11,74.31 R29.1
  Bottom Layer w0.203: v1(44.62,80.34) 47.06,82.78 104.87,82.78 v1(109.09,78.57)
TFT_B0: length 62.6
  Top Layer w0.152: v1(24.51,75.16) 24.62,75.28 26.91,75.28 ; v1(41.02,28.07) 41.44,28.49 41.44,31.93
  Bottom Layer w0.152: v1(24.51,75.16) 23.64,74.3 23.64,69.42 24.18,68.89 24.18,44.12 35.89,32.41 35.89,30.71 38.53,28.07 v1(41.02,28.07)
TFT_B1: length 61.8
  Top Layer w0.152: 39.21,78.08 39.21,74.83 37.66,73.28 v1(32.43,73.28) ; 41.95,32.4 41.9,32.45 v1(41.9,33.78)
  Bottom Layer w0.152: v1(32.43,73.28) 30.31,73.28 27.83,70.81 27.83,45.64 39.69,33.78 v1(41.9,33.78)
TFT_B2: length 62.8
  Top Layer w0.152: v1(42.61,35.1) 42.51,35 42.51,32.45 ; v1(35.12,71.3) 39.14,71.3 41.71,73.87 41.71,78.08
  Bottom Layer w0.152: v1(35.12,71.3) 30.27,71.3 29.21,70.24 29.21,46.79 41.1,34.89 42.41,34.89 v1(42.61,35.1)
TFT_B3: length 63.1
  Top Layer w0.152: 43.01,32.46 43.01,34.23 v1(43.22,34.44) ; v1(33.14,72.67) 37.92,72.67 39.71,74.46 39.71,78.08
  Bottom Layer w0.152: v1(33.14,72.67) 30.35,72.67 28.29,70.62 28.29,45.82 39.68,34.44 v1(43.22,34.44)
TFT_B4: length 60.7
  Top Layer w0.152: 43.47,29.56 43.47,32.25 FPC1.25 ; 30.21,78.08 30.21,78.07 v1(30.21,76.25)
  Bottom Layer w0.152: 43.42,29.56 41.97,29.56 26.46,45.07 26.46,71.48 30.21,75.23 v1(30.21,76.25)
  vias: v1(43.52,29.54)
TFT_B5: length 48.6
  Top Layer w0.152: 29.71,52.98 29.71,49.69 29.87,49.53 arc(29.99,49.24) 29.87,48.95 29.38,48.46 arc(29.38,47.88) 29.96,47.88 30.45,48.38 arc(31.02,48.38) 31.02,47.8 30.53,47.31 arc(30.53,46.73) 31.11,46.74 31.6,47.23 arc(31.89,47.35) 32.17,47.23 32.97,46.43 arc(33.26,46.31) 33.38,46.02 33.38,45.82 arc(33.79,45.41) 34.19,45.82 34.19,46.02 arc(34.6,46.43) 35.01,46.02 35.01,45.82 arc(35.41,45.41) 35.82,45.82 35.82,46.02 arc(36.22,46.43) 36.63,46.02 36.63,45.82 arc(37.04,45.41) 37.44,45.82 37.44,46.02 arc(37.54,46.29) 37.8,46.42 37.8,46.43 42.25,46.43 43.89,44.79 43.89,44 arc(44,43.71) 44.29,43.59 44.49,43.59 arc(44.9,43.19) 44.49,42.78 44.29,42.78 arc(43.89,42.37) 44.29,41.97 44.49,41.97 arc(44.9,41.56) 44.49,41.15 44.29,41.15 arc(43.89,40.75) 44.29,40.34 44.49,40.34 arc(44.9,39.93) 44.49,39.53 44.29,39.53 arc(44,39.41) 43.89,39.12 43.89,38.98 arc(44,38.69) 44.29,38.57 44.49,38.57 arc(44.9,38.17) 44.49,37.76 44.29,37.76 arc(43.89,37.35) 44.29,36.95 44.49,36.95 arc(44.9,36.54) 44.49,36.13 44.29,36.13 arc(43.89,35.73) 44.29,35.32 44.49,35.32 arc(44.9,34.92) 44.49,34.51 44.29,34.51 arc(44,34.39) 43.89,34.1 43.89,32.33
TFT_B6: length 62.6
  Top Layer w0.152: v1(44.39,30.88) 44.39,32.33 ; 33.21,78.08 33.21,77.08 34.38,75.91 34.38,74.57 33.85,74.04 32.08,74.04 v1(32.03,74.1)
  Bottom Layer w0.152: v1(32.03,74.1) 30.48,74.1 27.38,71 27.38,45.45 41.94,30.88 v1(44.39,30.88)
TFT_B7: length 63.7
  Top Layer w0.152: v1(33.19,74.86) 33.19,76.43 32.71,76.92 32.71,78.08 ; 44.89,32.33 45,32.22 v1(45,30.17)
  Bottom Layer w0.152: v1(33.19,74.86) 30.59,74.86 26.92,71.19 26.92,45.26 42.01,30.17 v1(45,30.17)
TFT_CLK: length 58.4
  Top Layer w0.152: v1(33.72,59.07) 34.99,60.34 46.42,60.34 48.09,58.67 49.11,58.67 49.5,59.06 49.5,65.4 49.87,65.78 52.01,65.78 ; 45.89,32.33 45.89,37.31 v1(45.81,37.38)
  Bottom Layer w0.152: v1(45.81,37.38) 45.59,37.38 33.35,49.63 33.35,58.7 v1(33.72,59.07)
TFT_DE: length 54.1
  Top Layer w0.152: 26.91,62.78 30.24,62.78 v1(30.25,62.77) ; v1(49.35,34.98) 49.35,34.67 47.89,33.21 47.89,32.33
  Bottom Layer w0.152: v1(49.35,34.98) 49.35,35.54 48.72,36.16 48.63,36.16 arc(48.34,36.05) 48.22,35.76 48.22,34.98 arc(47.81,34.57) 47.41,34.98 47.41,35.76 arc(47,36.16) 46.59,35.76 46.59,34.98 arc(46.19,34.57) 45.78,34.98 45.78,35.76 arc(45.38,36.16) 44.97,35.76 44.97,34.98 arc(44.56,34.57) 44.16,34.98 44.16,35.76 arc(44.04,36.05) 43.75,36.16 41.41,36.16 30.15,47.43 30.15,62.67 v1(30.25,62.77)
TFT_G0: length 53.1
  Top Layer w0.152: 37.06,30.66 37.43,31.03 37.43,31.92 ; v1(24.56,74.25) 25.09,74.78 26.91,74.78
  Bottom Layer w0.152: v1(37.05,30.66) 37.05,31.89 24.63,44.31 24.63,69.08 24.1,69.61 24.1,73.79 v1(24.56,74.25)
TFT_G1: length 53.4
  Top Layer w0.152: 26.91,74.28 25.65,74.28 v1(25.02,73.64) ; 37.93,32.28 37.93,30.34 v1(38.02,30.26)
  Bottom Layer w0.152: 38.02,30.25 38.02,31.57 25.09,44.5 25.09,69.27 24.56,69.8 24.56,73.18 v1(25.02,73.64)
TFT_G2: length 59.7
  Top Layer w0.152: v1(40.76,39.09) 38.38,36.71 38.38,32.46 38.44,32.39 ; v1(32.09,62.02) 34.02,63.95 39.97,63.95 50.29,74.28 52.01,74.28
  Bottom Layer w0.152: v1(40.76,39.09) 31.52,48.34 31.52,61.45 v1(32.09,62.02)
TFT_G3: length 59.7
  Top Layer w0.152: 40.19,78.06 40.19,73.32 38.88,72.01 v1(34.11,72.01) ; v1(38.93,36.15) 38.93,32.28
  Bottom Layer w0.152: v1(34.11,72.01) 30.33,72.01 28.75,70.43 28.75,46.33 38.93,36.15
TFT_G4: length 60.8
  Top Layer w0.152: 52.01,75.28 50.02,75.28 39.56,64.82 34.07,64.82 v1(33.09,63.83) ; 39.39,32.33 39.49,32.44 39.49,36.66 v1(40.97,38.13)
  Bottom Layer w0.152: v1(33.09,63.83) 31.06,61.8 31.06,48.04 v1(40.97,38.13)
TFT_G5: length 61.9
  Top Layer w0.152: 39.89,32.33 39.97,32.41 39.97,35.96 v1(41.17,37.16) ; 52.01,75.78 49.76,75.78 39.51,65.53 33.82,65.53 v1(32.18,63.88)
  Bottom Layer w0.152: v1(41.17,37.16) 30.6,47.73 30.6,62.31 v1(32.18,63.88)
TFT_G6: length 54.4
  Top Layer w0.152: 40.39,32.33 40.39,35.11 42.19,36.91 v1(42.19,37.47) ; v1(33.82,60.19) 34.68,61.06 41.24,61.06 48.46,68.28 52.01,68.28
  Bottom Layer w0.152: v1(42.19,37.47) 42.19,40.14 32.89,49.44 32.89,59.26 v1(33.82,60.19)
TFT_G7: length 68.1
  Top Layer w0.152: 50.21,78.08 50.21,76.89 44.01,70.69 v1(33.65,70.69) ; v1(41.85,35.61) 40.89,34.64 40.89,32.33
  Bottom Layer w0.152: v1(33.65,70.69) 30.31,70.69 29.66,70.05 29.66,47.2 41.2,35.66 41.8,35.66 v1(41.85,35.61)
TFT_HS: length 58.1
  Top Layer w0.152: FPC1.32 46.94,29.11 v1(46.76,28.93) ; v1(25.62,70.69) 25.71,70.78 26.91,70.78
  Bottom Layer w0.152: v1(25.62,70.69) 26.01,70.31 26.01,44.88 41.95,28.93 v1(46.76,28.93)
TFT_R0: length 54.5
  Top Layer w0.152: 33.39,32.33 33.39,38.54 33.17,38.76 arc(32.88,38.88) 32.59,38.76 32,38.17 arc(31.42,38.17) 31.42,38.74 32.02,39.34 arc(32.02,39.91) 31.44,39.91 30.85,39.32 arc(30.27,39.32) 30.27,39.89 30.87,40.49 arc(30.87,41.06) 30.29,41.06 29.7,40.47 arc(29.12,40.47) 29.12,41.04 29.72,41.64 arc(29.72,42.21) 29.15,42.21 28.55,41.62 arc(27.98,41.62) 27.98,42.19 28.57,42.78 arc(28.57,43.36) 28,43.36 27.4,42.76 arc(26.83,42.76) 26.83,43.34 27.42,43.93 arc(27.42,44.51) 26.85,44.51 26.25,43.91 arc(25.68,43.91) 25.68,44.49 26.27,45.08 arc(26.27,45.66) 25.7,45.66 25.1,45.06 arc(24.53,45.06) 24.53,45.64 25.12,46.23 arc(25.12,46.81) 24.55,46.81 23.95,46.21 arc(23.38,46.21) 23.38,46.79 23.97,47.38 arc(24.09,47.67) 23.97,47.96 23.71,48.22 23.71,49.13 arc(23.59,49.42) 23.3,49.54 23.1,49.54 arc(22.69,49.94) 23.1,50.35 23.3,50.35 arc(23.71,50.76) 23.3,51.16 23.1,51.16 arc(22.69,51.57) 23.1,51.98 23.3,51.98 arc(23.71,52.38) 23.3,52.79 23.1,52.79 arc(22.69,53.2) 23.1,53.6 23.3,53.6 arc(23.59,53.72) 23.71,54.01 23.71,54.4 24.56,55.24 26.87,55.24 26.91,55.28
TFT_R1: length 52.6
  Top Layer w0.152: FPC1.6 33.94,41.4 33.88,41.46 arc(33.59,41.58) 33.3,41.46 32.62,40.78 arc(32.05,40.78) 32.05,41.35 32.73,42.03 arc(32.73,42.61) 32.15,42.61 31.47,41.93 arc(30.9,41.92) 30.9,42.5 31.58,43.18 arc(31.58,43.76) 31.01,43.76 30.32,43.07 arc(29.75,43.07) 29.75,43.65 30.43,44.33 arc(30.43,44.91) 29.86,44.91 29.17,44.22 arc(28.6,44.22) 28.6,44.8 29.28,45.48 arc(29.28,46.06) 28.71,46.06 28.02,45.37 arc(27.45,45.37) 27.45,45.95 28.13,46.63 arc(28.13,47.2) 27.56,47.2 26.88,46.52 arc(26.3,46.52) 26.3,47.1 26.98,47.78 arc(26.98,48.35) 26.41,48.35 25.73,47.67 arc(25.15,47.67) 25.15,48.25 25.83,48.93 arc(25.95,49.22) 25.83,49.5 24.86,50.47 24.86,50.88 arc(24.98,51.17) 25.27,51.29 25.98,51.29 arc(26.39,51.69) 25.98,52.1 25.27,52.1 arc(24.86,52.51) 25.27,52.91 25.98,52.91 arc(26.39,53.32) 25.98,53.72 25.27,53.72 arc(24.98,53.84) 24.86,54.13 25.49,54.76 26.89,54.76
